# EAGLE schematic nomux1.2 (EAGLE 6.6.0)
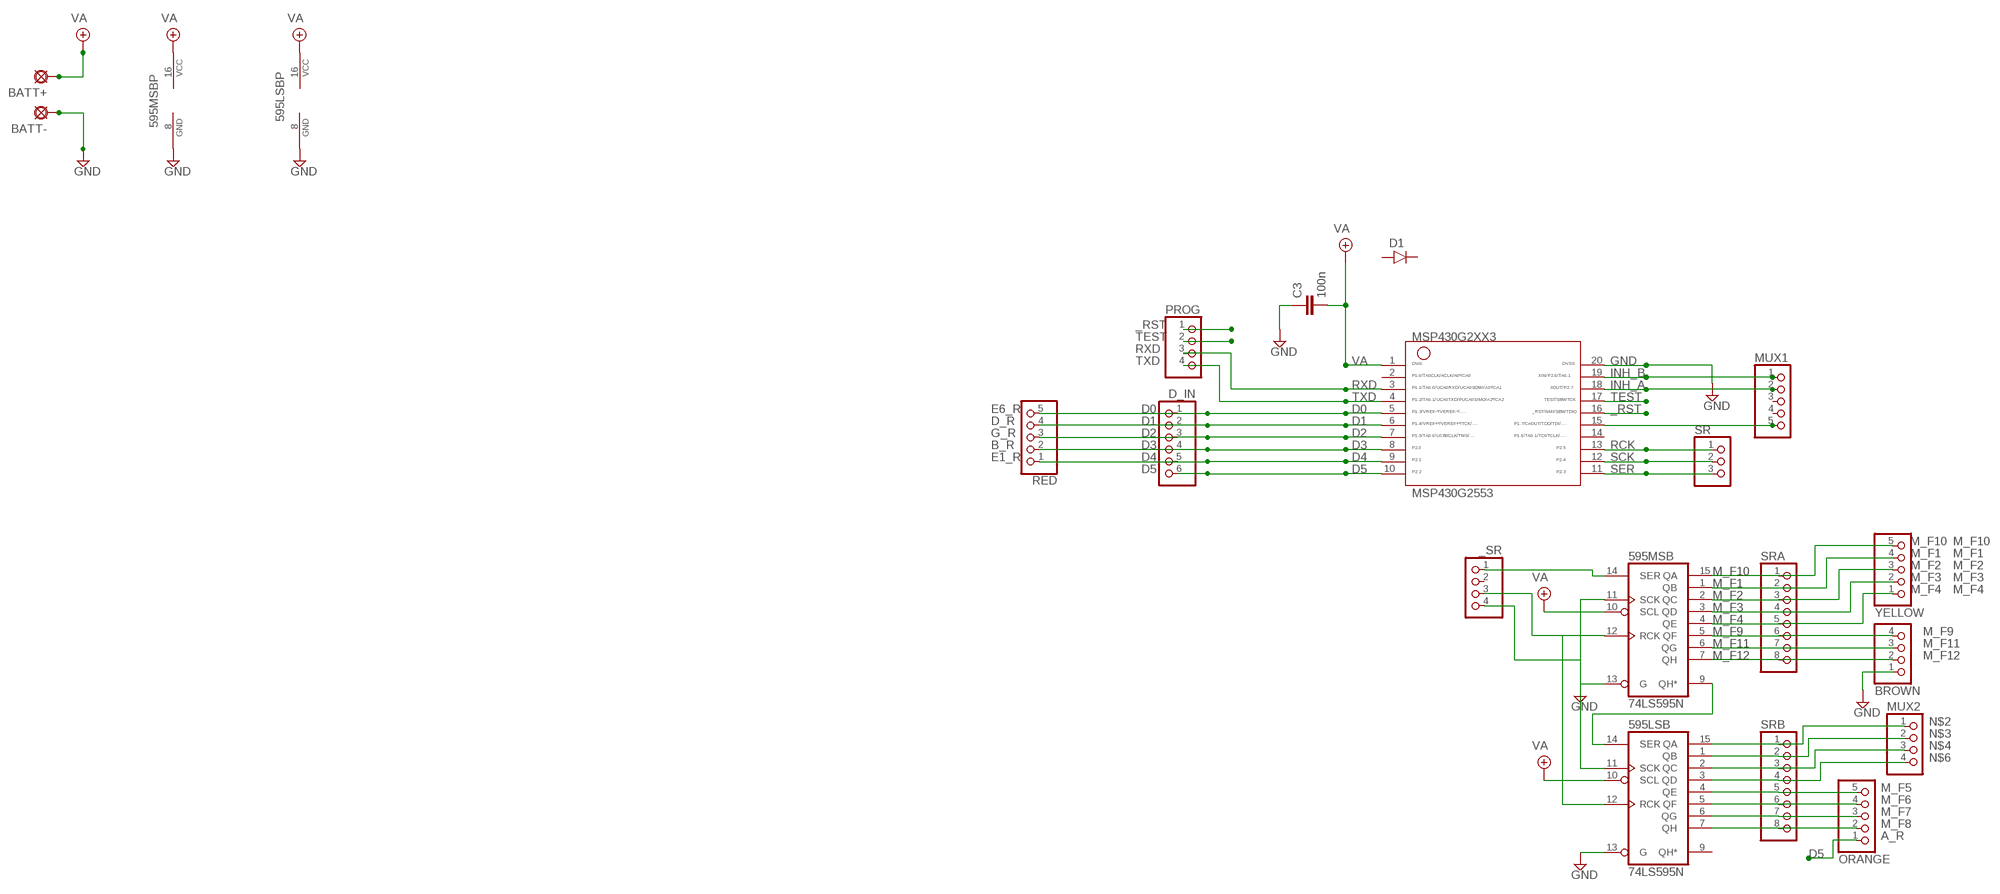
[diagram p0: schematic, sheet 1]

## Parts
595LSB  74LS595N  [DIL16]
595MSB  74LS595N  [DIL16]
_SR  PINHD-1X4  [1X04]
BATT+  PADL  [LONG]
BATT-  PADL  [LONG]
BROWN  PINHD-1X4  [1X04]
C3  100n  050X030_050  [050X030_050_3]
D1  1N400X.4  [DO41-4]
D_IN  PINHD-1X6  [1X06]
MSP430G2553  G2XX3---N20  [N20]
MUX1  PINHD-1X5  [1X05]
MUX2  PINHD-1X4  [1X04]
ORANGE  PINHD-1X5  [1X05]
PROG  PINHD-1X4  [1X04]
RED  PINHD-1X5  [1X05]
SR  PINHD-1X3  [1X03]
SRA  PINHD-1X8  [1X08]
SRB  PINHD-1X8  [1X08]
YELLOW  PINHD-1X5  [1X05]

## Nets
_RST: MSP430G2553.16 PROG.1
D0: D_IN.1 MSP430G2553.5 RED.5
D1: D_IN.2 MSP430G2553.6 RED.4
D2: D_IN.3 MSP430G2553.7 RED.3
D3: D_IN.4 MSP430G2553.8 RED.2
D4: D_IN.5 MSP430G2553.9 RED.1
D5: D_IN.6 MSP430G2553.10 ORANGE.1
GND: 595LSB.8(GND) 595LSB.13(G) 595MSB.8(GND) 595MSB.13(G) BATT-.1(PAD) BROWN.1 C3.1 MSP430G2553.20
INH_A: MSP430G2553.18 MUX1.2
INH_B: MSP430G2553.19 MUX1.1
M_F1: 595MSB.1(QB) SRA.2 YELLOW.4
M_F2: 595MSB.2(QC) SRA.3 YELLOW.3
M_F3: 595MSB.3(QD) SRA.4 YELLOW.2
M_F4: 595MSB.4(QE) SRA.5 YELLOW.1
M_F5: 595LSB.4(QE) ORANGE.5 SRB.5
M_F6: 595LSB.5(QF) ORANGE.4 SRB.6
M_F7: 595LSB.6(QG) ORANGE.3 SRB.7
M_F8: 595LSB.7(QH) ORANGE.2 SRB.8
M_F9: 595MSB.5(QF) BROWN.4 SRA.6
M_F10: 595MSB.15(QA) SRA.1 YELLOW.5
M_F11: 595MSB.6(QG) BROWN.3 SRA.7
M_F12: 595MSB.7(QH) BROWN.2 SRA.8
N$1: 595LSB.14(SER) 595MSB.9(QH*)
N$2: 595LSB.15(QA) MUX2.1 SRB.1
N$3: 595LSB.1(QB) MUX2.2 SRB.2
N$4: 595LSB.2(QC) MUX2.3 SRB.3
N$6: 595LSB.3(QD) MUX2.4 SRB.4
N$26: MSP430G2553.15 MUX1.5
N$27: 595MSB.14(SER) _SR.1
N$28: 595LSB.11(SCK) 595MSB.11(SCK) _SR.4
N$29: 595LSB.12(RCK) 595MSB.12(RCK) _SR.3
RCK: MSP430G2553.13 SR.1
RXD: MSP430G2553.3 PROG.3
SCK: MSP430G2553.12 SR.2
SER: MSP430G2553.11 SR.3
TEST: MSP430G2553.17 PROG.2
TXD: MSP430G2553.4 PROG.4
VA: 595LSB.10(SCL) 595LSB.16(VCC) 595MSB.10(SCL) 595MSB.16(VCC) BATT+.1(PAD) C3.2 MSP430G2553.1
Unconnected: 595LSB.9(QH*) _SR.2 D1.A D1.C MSP430G2553.2 MSP430G2553.14 MUX1.3 MUX1.4

## Notes on the sheet
- E6_R
- D_R
- G_R
- B_R
- E1_R
- M_F10
- M_F1
- M_F2
- M_F3
- M_F4
- A_R

## Library data of the parts
595LSB 595MSB = 74xx-us:74*595: 8-bit SHIFT REGISTER, output latch
_SR BROWN MUX2 PROG = pinhead:PINHD-1X4: PIN HEADER
BATT+ BATT- = gm-supply:PAD: PAD use this package for pads with any purpose, including input, output, send or return various pad shapes: round, square, octogonal, long, and long offset
C3 = gm-caps-ceramic:050X030_050: 120 - 150pF Xicon Ceramic Disc 5mm lead spacing
D1 = gm-diodes:1N400X: Rectifier Diodes often used in power supply to prevent damage from reverse polarization
D_IN = pinhead:PINHD-1X6: PIN HEADER
MSP430G2553 = TI_MSP430_v16:G2XX3---N20: MSP430G2XX1 PDIP (N) 20 Pin Package
MUX1 ORANGE RED YELLOW = pinhead:PINHD-1X5: PIN HEADER
SR = pinhead:PINHD-1X3: PIN HEADER
SRA SRB = pinhead:PINHD-1X8: PIN HEADER